# Altium schematic sheet Sheet1.SchDoc
size A4; SheetNumber: 1; SheetTotal: 1; SPICEModelCacheQXQFBDSR: <root> / <DocumentId>QXQFBDSR</DocumentId> / <CacheFrame Number="0"> / <Model Name="lp5907_3p0_trans" Kind="CKT"> / <Text>**$ENCRYPTED_LIB / **$INTERFACE / * PSpice Model Editor - Version 16.2.0 / *$ / * LP5907_3P0 / ***************************************************************************** / * (C) Copyright 2017,2012 Texas Instruments Incorporated. All rights reserved. / ***************************************************************************** / ** This model is designed as an aid for customers of Texas Instruments. / ** TI and its licensors and suppliers make no warranties, either expressed / ** or implied, with respect to this model, including the warranties of / ** merchantability or fitness for a particular purpose. The model is / ** provided solely on an "as is" basis. The entire risk as to its quality / ** and performance is with the customer. / ***************************************************************************** / * / * This model is subject to change without notice. Texas Instruments / * Incorporated is not responsible for updating this model. / * / ***************************************************************************** / * / ** Released by: WEBENCH Design Center, Texas Instruments Inc. / * Part: LP5907_3P0 / * Date: 05JUN2017 / * Model Type: Transient / * Simulator: PSPICE / * Simulator Version: 16.2.0.p001 / * EVM Order Number: / * EVM Users Guide: / * Datasheet: SNVS798L APRIL 2012REVISED SEPTEMBER 2016 / * / * / * Model Version: Final 1.10 / * / ***************************************************************************** / * / * Updates: / * / * Final 1.10 / * Release to Web / *&lt;Made below changes to the model&gt; / * 1. Model supports floating ground and made compliant with new template. / * / * Final 1.00 / * Release to Web / * / ***************************************************************************** / * / * Model Usage Notes: / * / * 1. The following features have been modeled / *      a. Start-up time / *      b. PSSR / *      c. Enable/VIN shutdown / *      d. Load and line transients / *      e. Internal current limit / *      f. Model supports inverting topology. / * / * / * 2. Temperature effects &amp; Ground/quiescent current have not been modeled. / * / ***************************************************************************** / .SUBCKT LP5907_3P0_TRANS EN VIN VOUT N_C GND / $CDNENCSTART / eee8c5c7a2bc4b01f045f303678664e7916da0bae22e8cb0bba041dd67c69ce448ea70148a9ac1670c8926c1ac5057c8ccfcd77bf87ca9dc1f2237338a6ef39d / 0dea85bdd2f6170515f60e4ce62d5ce4f42b1ac717dd32555170a8e333648715f562e78474a33860560cb52aa9aabd08162db2a33972403f8ec095416ef1402c / 23ee73d6065f3641a60fd3951de4fe94e0b5dbf27fe7bf8f8855cd663d22bb25644126c9831a96bdc8e5a32375110da8033006ed9ac5d2d19e3592265a7ac25a / c9df73872fc604505141f95a167e875cb8368eb63c4c192b1dbaaf9d294d8e9748da025e697215716ac3f3c79dcf3e27303d7240d8c3139d1f2237338a6ef39d / c6ada2f6665016df0abfc569c2f155649bb0d004119ec15edac27046788386e08c268da1b8c6e14d7fe15ab6e0b5072f9f339ae728025ac59258806fc7cc43d8 / 6f9764b062a618461b335ff6669122153465e12ae9d7d9c7a434cb3c571aa35fcf8e67772046bd39de85e4e2d68b498f6dba65afb526cbc1a2029afaa2b4a68e / 0be1bd08545f4ec3706b807646b80371d6b573c4fef92654bdbd52ddbaa047e44f8bfb77fa42da9ca5c0f1a70fbc358fb8558acfd32419a886391aa7db33436a / 82d2e7992b7a58af706b807646b803716eccaf694fc8cbd852bd4e0d98b91e0393c1d0241c58b19c8c1b61a2a3408b1c3b31ab4d5157bebb045e35488dc8d857 / 96cc4b5209c35bf775963efd3ee34e16f562e78474a33860560cb52aa9aabd08162db2a33972403f2b4240fc250814d9757d9762d76573a2de58ab941dd37bc2 / cdaa385411811e27bfd81d659a09e4b32637e9cac2aa5cea2cecad1ebf804c4bf467148f06ca8e43b386cdd95d344e224c0b6f0d39a92da161003feb9e39e6bc / 5aa875be979324eb706b807646b803717dcd3f16f2f4a72c7eda79482ff3735885c2b9ec79784b734f171b0ac1178905b3e9d0eff77948c660f3e64cab793fd4 / 6dcc2999c2dfe559706b807646b8037152bd4e0d98b91e036547a759992af1d01ed3b068a02ead27a5c0f1a70fbc358fb8558acfd32419a886391aa7db33436a / 0a40497471b1851d706b807646b8037110fe20894a82e47899b87aceb23e86979bd52e24aaba9e8d7538df4596c8873b644126c9831a96bddad715ff2fd3051c / 311fb123761f1dd1939d8e8a60715c719bce09d5b25a2abbebab489077a612d43deed04c860f4203446c0a8b5840e648b6adb3acb41df66c7a119c9a925e903a / 999885ffe318eff0a5c0f1a70fbc358fb8558acfd32419a8e52b5eff4bb48eb945ddc6a4b72796469aa0f149b272f6822a0a30f438cac9930696f6a37d129d35 / e9f419af62bfe95eb585b96681e0ca9ba21192fade6c61218492e52ca990713774bd84a1f90ee88cdd6200a649fb305b94754a223418ccdb2be4545d89eca38c / 6d35d8485846d69902bd25eaa8c8a8117df3afe1fbfc11e3dc7abd4485ee9f8e6290bd1a849bbcaaf829d8c08e2df90b3e7542e0267ca578508313674356fb94 / 10f459d39ee6f8ae706b807646b80371a4f10b3120454571f2810f0bed6a6bb9267ed4ac3759fd051c6ffcdd96e3dd45844da759261db9861f2237338a6ef39d / 69ff18044fae7c89706b807646b8037152bd4e0d98b91e03a4a705036dcc71cc1471cd15dabb62faa5c0f1a70fbc358fb8558acfd32419a886391aa7db33436a / 1e36f10390632b7b706b807646b8037152bd4e0d98b91e03d126183a007ec7da5a3bd16bf5766b7522c2ca6031933b14abdc18ad19c6370052dba193271012d0 / bee3b1535c1d5d6b644126c9831a96bdc8e5a32375110da8033006ed9ac5d2d1afd69b5275785a510a61135c65b4240f7f2bbe2210c0cd5b5bc1a718246f5080 / 22cc75479b3d980a706b807646b8037180a93b86ccc5ef96b81e4c4d969f1dd2ca3bf768e25b6b29ac6a06391c26b0c664bcc0a497fc04bab60ed022882a5e96 / 1ac3d64a7ec42565706b807646b80371fafbb00062b4cc8e5a87424d006993fbf4ff3965adf04b6de23d827c2a5cdd2f1d40db20570fad7864386207709a88c4 / a8fd19f33527d4f2b045c149b70fbd518c268da1b8c6e14d7fe15ab6e0b5072f9f339ae728025ac5f9ddf8ad585c1707b0641cfbbf3b64bdb8c03661254f4d72 / cdaa385411811e27bfd81d659a09e4b32637e9cac2aa5cea2cecad1ebf804c4bf467148f06ca8e43b386cdd95d344e224c0b6f0d39a92da161003feb9e39e6bc / 54653036f112a7e5706b807646b80371989ff71a450f2d4f43ff7de80bac908e0b2915792e5120cd0afc85f6633d60b0042f0c0c78bb0deba2029afaa2b4a68e / 9d3782a54af54f6d706b807646b80371989ff71a450f2d4f880b50147c27929900877b91cd4279f39377af7e54bb163fc1303b74a0359d38f6c8b208a55c3008 / 8df0563ff6b12bcb706b807646b803717dcd3f16f2f4a72c970368879395e64fb108abd8f0d8760ca5c0f1a70fbc358fb8558acfd32419a886391aa7db33436a / f28257b2a3730294706b807646b80371a847f3fb487c186c2e10b6f40aa50ec73034a5f774424fca02bd25eaa8c8a8117df3afe1fbfc11e3642308046b4ea694 / a5d158a0fc11634f706b807646b8037180a93b86ccc5ef96dcdb6b3481be0e8956bfede5d11cc7ca4f171b0ac1178905b3e9d0eff77948c660f3e64cab793fd4 / e9f419af62bfe95ec12e63f53fc8b6c7080dbdc2111b05ac8137f3f5199c34a1ce5ec34e6f8ad1ca5a7677ff1b3f4c2798db71085172481be0e3731929278ec6 / 3487eaf1c64d3e9be98f5b980e01c859aa11a96fd77a05cac8e5a32375110da8033006ed9ac5d2d1afd69b5275785a510a61135c65b4240ff30e0e5d2ed91cb1 / ce7c56cb096546916589144859c4b12fb5f1c17ee7956303b386cdd95d344e224c0b6f0d39a92da103c1359a395fea4edf42d85a8257809120f58e0d0db27768 / e9f419af62bfe95ebc27f931268b4061080dbdc2111b05ac281216a7cb15249ace5ec34e6f8ad1cac13ffc8b6ae5cb2e4c21dace8c0b77c7ecd58aec06da121d / 5d078000650a8fa5907b99823f1386611647afe0495b1ace45b47fa4a900dd804f447fc7bfeaab9e02bd25eaa8c8a8117df3afe1fbfc11e3642308046b4ea694 / a3ce589fda26bc39706b807646b80371989ff71a450f2d4f552dbe3b9f96257d713efb65723a80ebd53698db8c1cb0e024fdfd9bb2e10b07b60ed022882a5e96 / f9b0e0bab8595c63706b807646b803710c93db79923e59d4d97ed74d8488316a1fd0fe96cad713b855371616c1c9f36f1c805e0c37824e95e89729e5d38ef58f / e9f419af62bfe95ecc0121b5e20e2076080dbdc2111b05acde91212396735d2ace5ec34e6f8ad1caf93f7b40a8e2bd3108c0f85e1bde808a956711648fdaafb1 / 0a74212461f65cb976d50cd002ed44083e433ab1299f423f6954020319aab50ff562e78474a33860560cb52aa9aabd08162db2a33972403f8ec095416ef1402c / bc8ee2299b220803beda7935c8aeca8d90d894e251243331dc0745283a910a9d564ac05b97e34c8c3343357705743cd11b1b8528953e7c05c5653993202dbdc5 / 02dac6cba784505e706b807646b8037180a93b86ccc5ef961fd0fe96cad713b8ec673e334d6e7ccd24fdfd9bb2e10b07a5c0f1a70fbc358fd92a745ddd778fe4 / b67df0d3ab862a12706b807646b80371a847f3fb487c186c7546fb5c8c4298ec3034a5f774424fca02bd25eaa8c8a8117df3afe1fbfc11e3642308046b4ea694 / bedb4c285028d3890abfc569c2f155648a39127aa9f8cf3378b54ce720b1001e5b9f79f666c8fe0048c4805203a5c1374f171b0ac1178905fd2707d3f952d1fb / 5637fcfd860683a92531ce9df5eb060381d6b57981cd92143fcc20578536d17e644126c9831a96bdc8e5a32375110da8033006ed9ac5d2d19e3592265a7ac25a / 48a94d11d238250f1e8d99a34d90bf6e62e88611cf6e71252d04475a671a0efda43968df6d6616e3b5582e7414710ac9644126c9831a96bddad715ff2fd3051c / e644fc3843e7ff1b15f60e4ce62d5ce4a468356d867f8b503a870bda96023ed7f6bdaa4da8832bb84f171b0ac1178905b3e9d0eff77948c660f3e64cab793fd4 / 336ab444b7c2ade71b335ff6669122150e68485587411f9a8492e52ca99071375bebda023e3dc91e71802e7452fd18b248c4805203a5c137f2f761ab7704e778 / a3f576b848cd34f915f60e4ce62d5ce4b8a226473598a56b027888eba959f92eb19075ca5679628a564ac05b97e34c8c3343357705743cd1f2b50d82304ae07a / 4036fe3bb1fccadcf45310c19b6b8ee599a0991fc74259832333a016061f78ba24fdfd9bb2e10b07a5c0f1a70fbc358fb8558acfd32419a886391aa7db33436a / 93d3808648446fd760c210771409cb2ee0b5dbf27fe7bf8f28012d945d685fb43bfc0ce7f97e07f14f171b0ac1178905b3e9d0eff77948c660f3e64cab793fd4 / 3d438685e8d81df08ce6c355cecd73173a9f2b15e1549f82d2cba97a6fa780a058b7694ea940380f4aad8c443740098ea8c91e20f198ecd4b60ed022882a5e96 / c0ff0c48b49f7f336b2aa09c0af3df1469b84f995ab9051c8e9fda988b24bba9c64d81576cf5798f00d3e0b087c737444f171b0ac1178905fd2707d3f952d1fb / c858d814c56a2bccc83805c2174809e89f01b7b69d9219a4f0974baff00f663252a385cff0ff5105bd64bf1a73d7cdffcdbbb8dee99590171f2237338a6ef39d / b0eb42ca922cce592fbfcc2b872ff946b18d7f6c9478f926749d13634498f34b68c3b9926e0df71ceaaf7045263d8c48311203d0aeae6b284549675fbefb5cdc / 878ea891db46c1cd9b17b472ccd6ffe7644126c9831a96bdc8e5a32375110da8033006ed9ac5d2d1afd69b5275785a510a61135c65b4240ff30e0e5d2ed91cb1 / be933631531f965902bd25eaa8c8a8117df3afe1fbfc11e3dc7abd4485ee9f8e6290bd1a849bbcaaf829d8c08e2df90b3e7542e0267ca578508313674356fb94 / 9afa1f10a7f457ea15f60e4ce62d5ce4268ffed78a3448457725dab847e703f63d1e66e16b42006a644126c9831a96bdc8e5a32375110da889a2796fbfb67ca0 / 5c2e262d493b312f305eaeda4ae775d7c195100027f00a3fba105b629766a2e000d3e0b087c737444f171b0ac1178905b3e9d0eff77948c660f3e64cab793fd4 / 5f41a7a4794b53672c4cbab029189320d042b92eba138a7c9f7df7e1d8537137dc26028ef70590f4b5f1c17ee7956303b386cdd95d344e22338cb575f6b9cea3 / ddf70eae3b592905a60fd3951de4fe94b6c5413836fc187c4b41ee992fe28b1ff562e78474a33860560cb52aa9aabd08162db2a33972403f8ec095416ef1402c / e0bee0f3fadd672460c210771409cb2ee0b5dbf27fe7bf8f1f2fb368fccc6be125d40f775a64a0940cafcb7cfe652d94bf1ee911780421dd1f2237338a6ef39d / f80a395284a571112fbfcc2b872ff9468e9fda988b24bba9e5e7fade4086c0d1d3b99b01fef3c644b016893e7e47cfd682b96d0b5ade7e97484379fba1bca2d2 / 062e5f2e0baf1b671b335ff6669122158a831dedbf5e05f78492e52ca99071374791d9b7e0db60db3efcea856e03cbcb8c268da1b8c6e14d89160f2754c96160 / 705d459f50f7a08c15f60e4ce62d5ce4b1e7b82b4260120d8f71e7553e806398042f0c0c78bb0deb564ac05b97e34c8c3343357705743cd1f2b50d82304ae07a / 394197bedeb77a71acab1d0766be876cdc171ccd3489847ae1dccbcbafa30549bf1ee911780421ddb386cdd95d344e224c0b6f0d39a92da161003feb9e39e6bc / b052355e65d40bda1e8d99a34d90bf6ec9ff7abb021b1d34250ab162ede77ed0bbc3d254e7d5d10548f47e6a1b8fd4c6a1943618832707cff2f761ab7704e778 / b90e0c5fe970b38760c210771409cb2e9bb0d004119ec15e777d4715d3c53dd141d49fca179af79dbaee13068f3f98a9dfe18481da70a6599d6bedf9d0034ac8 / 904e90e8e5b2fbfdf45310c19b6b8ee599a0991fc74259832333a016061f78ba24fdfd9bb2e10b07a5c0f1a70fbc358fb8558acfd32419a886391aa7db33436a / 615a28c46d72374094fbbbfac28a5c5c164c9e232793a5b0e99f6ae89c8b7ae302bd25eaa8c8a8117df3afe1fbfc11e3dc7abd4485ee9f8e06f446f73ef208be / 2f646e0e8d7ca9fb860341bb47536c89d3c6f4cd3b9e53669f7df7e1d853713798709113e7ea04d2b5f1c17ee7956303b386cdd95d344e22338cb575f6b9cea3 / 717cdf892ff6b6ffa60fd3951de4fe94f62cc45356863029bf1ee911780421ddb386cdd95d344e224c0b6f0d39a92da103c1359a395fea4e2547cfd16916d128 / 6a30044ee8eb8b67df94e35e4efbe801a81b64b03c55448366eaeb9fc4cc8ae1d7fdd13664b19a3da770ffc06755e0b9564ac05b97e34c8c1ec113823609ffcc / 2cfd781695004e385050367ff4393fd0f5957e86a35dee97669eef4894e6ebd591d2aeffe375b62981f87bf823608f41a6f0273a70365cec890995cd4f67537c / d8085d82d8686840ed8ce2e705c14ecfc8e5a32375110da8033006ed9ac5d2d1afd69b5275785a510a61135c65b4240f7f2bbe2210c0cd5b5bc1a718246f5080 / 47d63904790b4c5b964cb18042fc708b34fecbdc2e9ff42a885a6f1714ca32ab8b8d03f66b3294c2e1dfb3f47a4ac658dc67d6d46927fdbdf2f761ab7704e778 / $CDNENCFINISH / .ENDS LP5907_3P0_TRANS</Text> / </Model> / </CacheFrame> / </root>
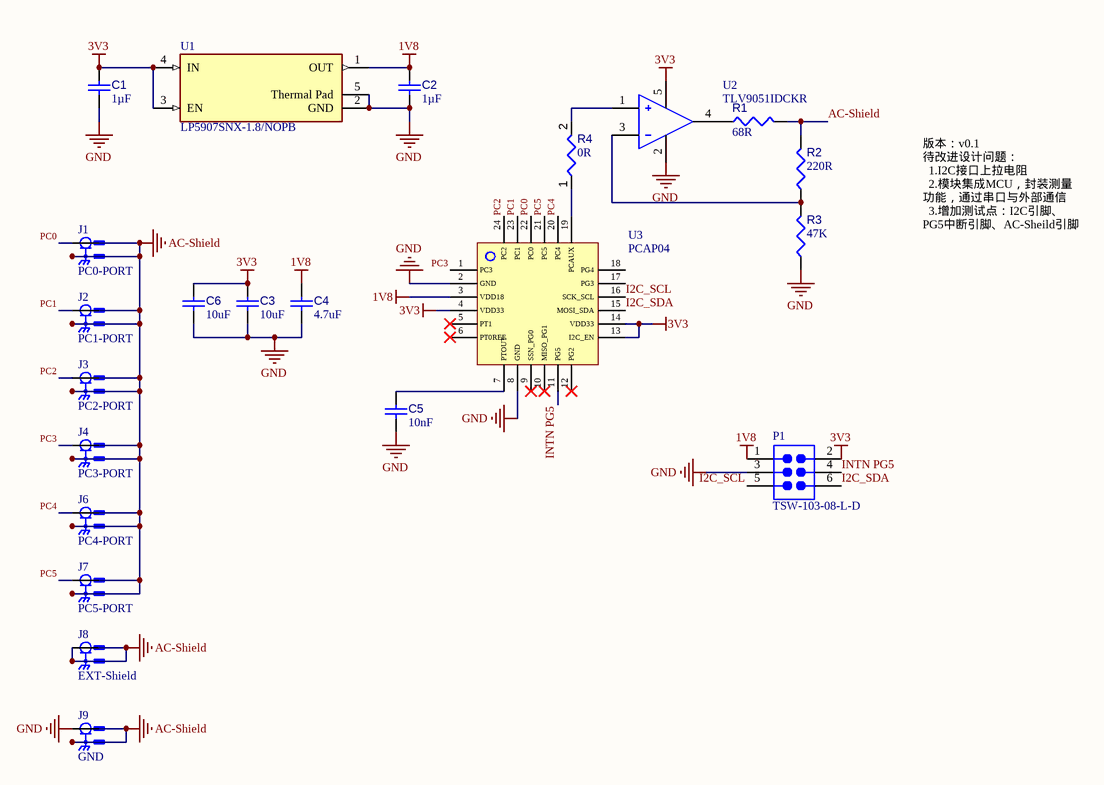
[diagram p0: Sheet1.SchDoc]

## Parts
C1  value 1µF  [CAPC0402(1005)60_L]  (hidden comment: Capacitor 1µF +/-20% 10V 0402)
C2  value 1µF  [CAPC0402(1005)60_L]  (hidden comment: Capacitor 1µF +/-20% 10V 0402)
C3  value 10uF  [CAPC0402(1005)60_L]  (hidden comment: Capacitor 10µF +/-40% 6.3V 0402)
C4  value 4.7uF  [CAPC0402(1005)60_L]  (hidden comment: Capacitor 10µF +/-40% 6.3V 0402)
C5  value 10nF  [CAPC0402(1005)60_L]  (hidden comment: Capacitor 10nF +/-20% 50V 0402)
C6  value 10uF  [CAPC0402(1005)60_L]  (hidden comment: Capacitor 10µF +/-40% 6.3V 0402)
J1  PC0-PORT  [LINX_CONMHF4-SMD-G-T]
J2  PC1-PORT  [LINX_CONMHF4-SMD-G-T]
J3  PC2-PORT  [LINX_CONMHF4-SMD-G-T]
J4  PC3-PORT  [LINX_CONMHF4-SMD-G-T]
J6  PC4-PORT  [LINX_CONMHF4-SMD-G-T]
J7  PC5-PORT  [LINX_CONMHF4-SMD-G-T]
J8  EXT-Shield  [LINX_CONMHF4-SMD-G-T]
J9  GND  [LINX_CONMHF4-SMD-G-T]
P1  TSW-103-08-L-D  [SMTC-TSW-103-08-X-D]
R1  value 68R  [RESC0402(1005)_L]  (hidden comment: Resistor 10R  +/-1 % 0402 63 mW)
R2  value 220R  [RESC0402(1005)_L]  (hidden comment: Resistor 10R  +/-1 % 0402 63 mW)
R3  value 47K  [RESC0402(1005)_L]  (hidden comment: Resistor 10R  +/-1 % 0402 63 mW)
R4  value 0R  [RESC0402(1005)_L]  (hidden comment: Resistor 10R  +/-1 % 0402 63 mW)
U1  LP5907SNX-1.8/NOPB  [FP-DQN0004A-MFG]
U2  TLV9051IDCKR  [FP-DCK0005A-IPC_A]
U3  PCAP04  [QFN-24-PAD]

## Nets
1V8: C2.1 C4.2 P1.1 U1.1(OUT) U3.3(VDD18)
3V3: C1.1 C3.2 C6.2 P1.2 U1.3(EN) U1.4(IN) U2.5(V+) U3.4(VDD33) U3.13(I2C_EN) U3.14(VDD33)
AC-Shield: J1.S1 J1.S2 J1.S3 J2.S1 J2.S2 J2.S3 J3.S1 J3.S2 J3.S3 J4.S1 J4.S2 J4.S3 J6.S1 J6.S2 J6.S3 J7.S1 J7.S2 J7.S3 J8.1 J8.S1 J8.S2 J8.S3 J9.S1 J9.S2 J9.S3 R1.2 R2.2
GND: C1.2 C2.2 C3.1 C4.1 C5.1 C6.1 J9.1 P1.3 R3.1 U1.2(GND) U1.5(Thermal_Pad) U2.2(V-) U3.2(GND) U3.8(GND)
I2C_SCL: P1.5 U3.16(SCK_SCL)
I2C_SDA: P1.6 U3.15(MOSI_SDA)
INTN PG5: P1.4 U3.11(PG5)
PC0: J1.1 U3.22(PC0)
PC1: J2.1 U3.23(PC1)
PC2: J3.1 U3.24(PC2)
PC3: J4.1 U3.1(PC3)
PC4: J6.1 U3.20(PC4)
PC5: J7.1 U3.21(PC5)
NetC5_2: C5.2 U3.7(PTOUT)
NetR1_1: R1.1 U2.4(OUT)
NetR2_1: R2.1 R3.2 U2.3(IN-)
NetR4_1: R4.1 U3.19(PCAUX)
NetR4_2: R4.2 U2.1(IN+)

Not connected (* = marked no-connect by the designer): U3 5(PT1)* 6(PT0REF)* 9(SSN_PG0)* 10(MISO_PG1)* 12(PG2)* 17(PG3) 18(PG4)

## Notes on the sheet
- 版本：v0.1
  待改进设计问题：
  1.I2C接口上拉电阻
  2.模块集成MCU，封装测量功能，通过串口与外部通信
  3.增加测试点：I2C引脚、PG5中断引脚、AC-Sheild引脚

## Library data of the parts
C1 C2 = CMP-001-00063-3: Chip Capacitor, 1µF +/-20%, 10V, 0402, Thickness 0.6 mm; Tolerance: 10%; Mounting Technology: SMT; Max Operating Temperature: 85°C; Voltage Rating: 10V; Pins: 2; Case/Package: 0402; Min Operating Temperature: -55°C
C3 C4 C6 = CMP-001-00074-3: Chip Capacitor, 10µF +/-40%, 6.3V, 0402, Thickness 0.6 mm; Tolerance: 10%; Case/Package: 0402; Pins: 2; Mounting Technology: SMT; Voltage Rating: 6.3V; Max Operating Temperature: 85°C; Min Operating Temperature: -55°C
C5 = CMP-001-00069-3: Chip Capacitor, 10nF +/-20%, 50V, 0402, Thickness 0.6 mm; Tolerance: 5%; Max Operating Temperature: 85°C; Pins: 2; Case/Package: 0402; Voltage Rating: 50V; Min Operating Temperature: -55°C; Mounting Technology: SMT
J1-J4 J6-J9 = CMP-002-00072-1: IPEX MHF4 Connector Jack, Male Pin 50Ohm Surface Mount Solder; MF: Linx Technologies Inc.; MP: CONMHF4-SMD-G-T; Design Item ID: CONMHF4-SMD-G-T; Availability: In Stock; SnapEDA_Link: https://www.snapeda.com/parts/CONMHF4-SMD-G-T/Linx/view-part/?ref=snap; Pins: 4; Purchase-URL: https://pricing.snapeda.com/search/part/CONMHF4-SMD-G-T/?ref=eda; Case/Package: None; Check_prices: https://www.snapeda.com/parts/CONMHF4-SMD-G-T/Linx/view-part/?ref=eda; Price: None; Source: CONMHF4-SMD-G-T.SchLib; Component Type: Standard; Value: *
P1 = CMP-1024-00336-1: 0.025" SQ Post Header, Through-hole, Vertical, -55 to 125 degC, 2.54 mm Pitch, 6-Pin, Male, RoHS; Manufacturer: Samtec; Pitch: 2.54 mm; PackageVersion: DM, 8/1988; ComponentLink3Description: Package Specification; ComponentLink2Description: Datasheet; RoHS: True; ComponentLink1URL: http://www.samtec.com; PackageDescription: .025[0.64] SQ. Post Terminal Strip Assembly; PackageReference: TSW-103-08-X-D; Mounting Technology: Through-hole; DatasheetVersion: F-214; ComponentLink1Description: Manufacturer URL; Temperature Range: -55 to 125 degC; ComponentLink2URL: http://www.samtec.com/documents/webfiles/pdf/TSW_TH.PDF; ComponentLink3URL: http://www.samtec.com/documents/webfiles/cpdf/TSW-XXX-XX-XXX-X-XX-XXX-MKT.pdf; PartNumber: TSW-103-08-L-D; Orientation: Vertical
R1-R4 = CMP-009-00152-3: Chip Resistor, 10 Ohms, +/-1 %, 63 mW, -55 to 155 degC, 0402; Tolerance: 1%; Power: 63mW; Pins: 2; Max Operating Temperature: 155°C; Min Operating Temperature: -55°C; Case/Package: 0402
U1 = CMP-04917-000185-2: None
U2 = CMP-04895-000451-1: IC OPAMP GP 1 CIRCUIT SC70-5
U3 = PCAP04: CDC IC